# EAGLE design SHTC3 Breakout (EAGLE 9.1.3)
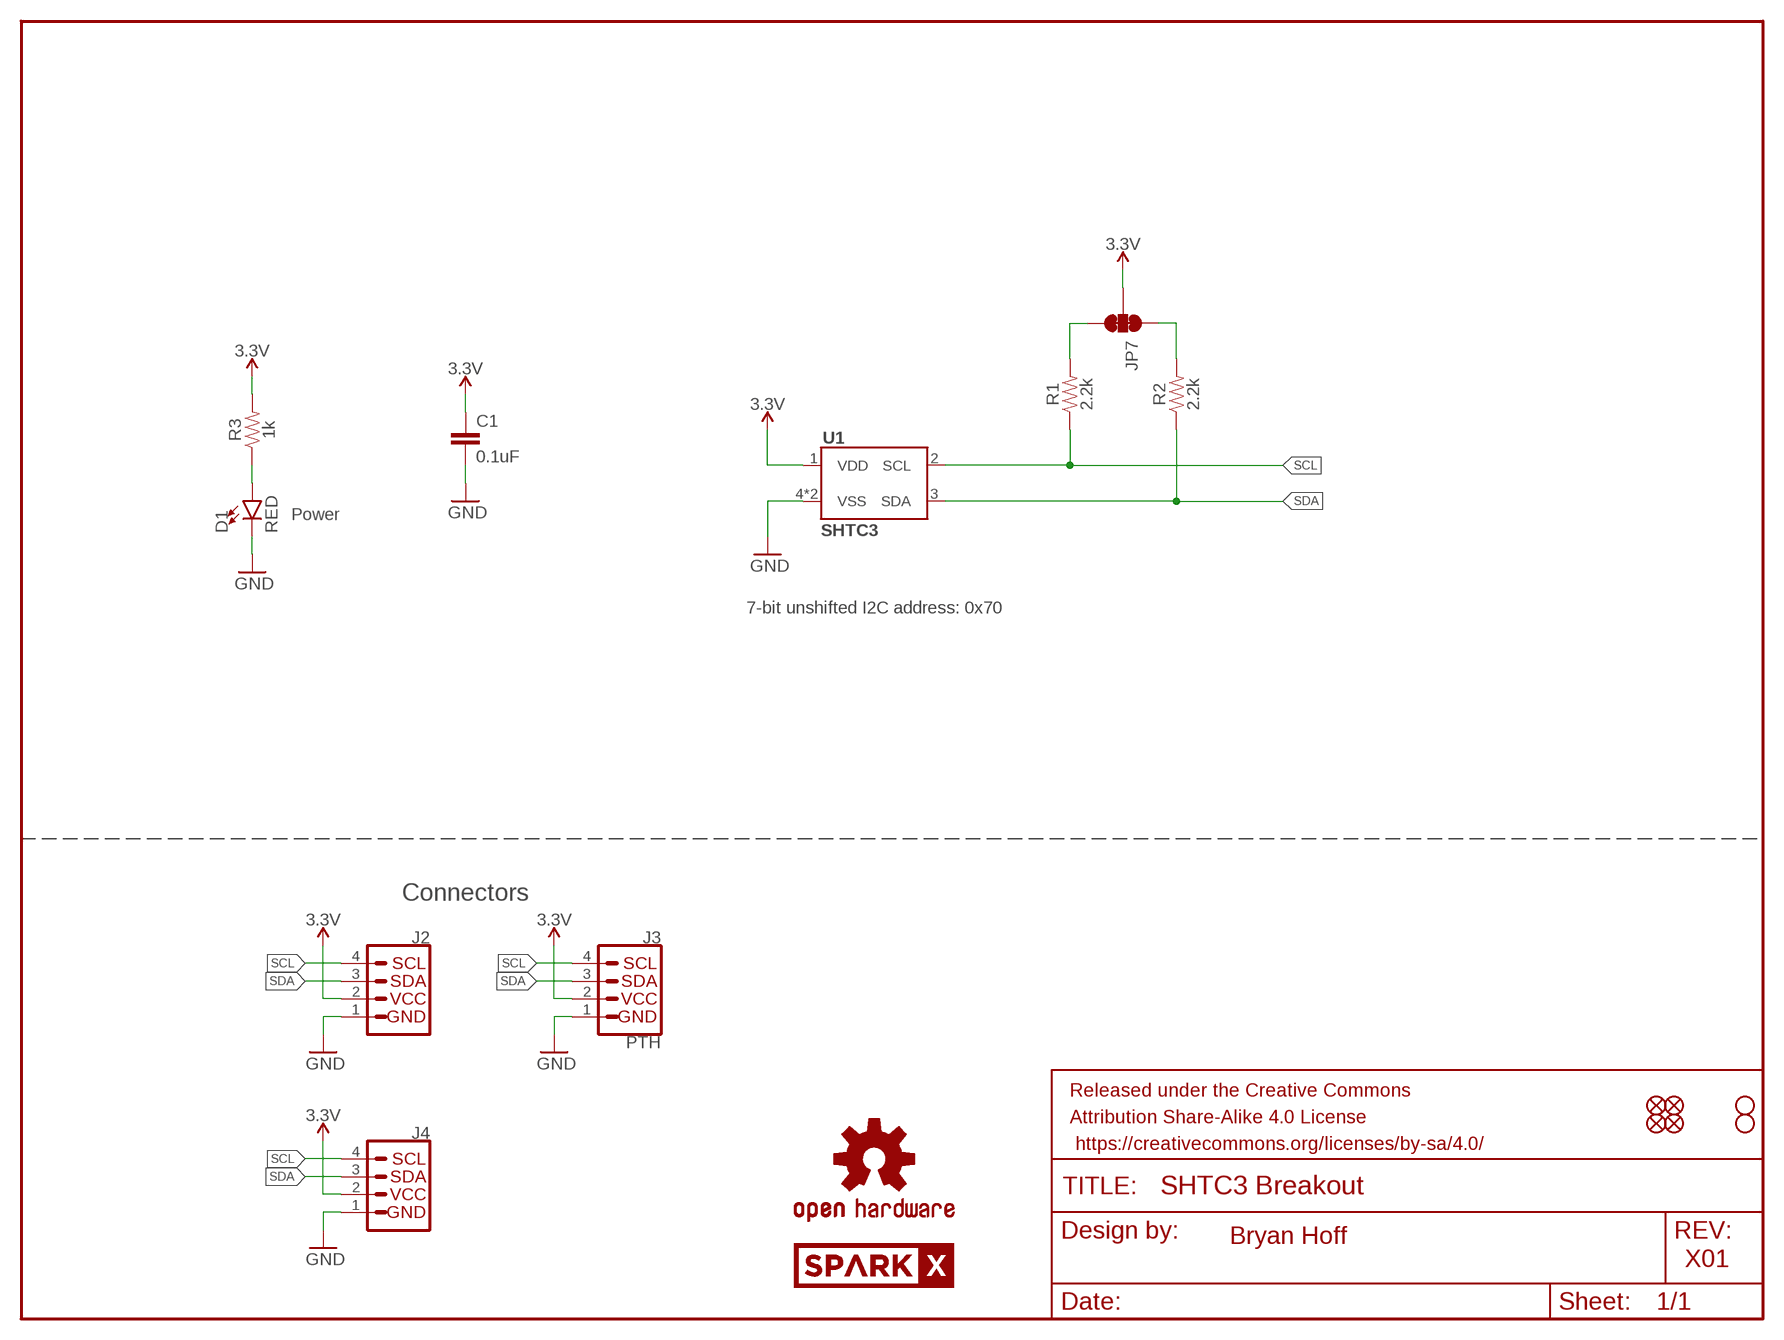
[diagram p0: schematic, sheet 1]

## Parts
C1  0.1uF  0.1UF-0603-25V-(+80/-20%)  [0603]
D1  RED  LED-RED0603  [LED-0603]
FRAME1  FRAME-LETTER  [CREATIVE_COMMONS]
J2  QWIIC_CONNECTORJS-1MM  [1X04_1MM_RA]
J3  PTH  I2C_STANDARD_NO_SILK  [1X04_NO_SILK]
J4  QWIIC_CONNECTORJS-1MM  [1X04_1MM_RA]
JP1  FIDUCIALUFIDUCIAL  [MICRO-FIDUCIAL]
JP2  FIDUCIALUFIDUCIAL  [MICRO-FIDUCIAL]
JP3  STAND-OFF  [STAND-OFF]
JP4  STAND-OFF  [STAND-OFF]
JP5  FIDUCIALUFIDUCIAL  [MICRO-FIDUCIAL]
JP6  FIDUCIALUFIDUCIAL  [MICRO-FIDUCIAL]
JP7  JUMPER-SMT_3_2-NC_TRACE_SILK  [SMT-JUMPER_3_2-NC_TRACE_SILK]
LOGO1  OSHW-LOGOMINI  [OSHW-LOGO-MINI]
R1  2.2k  2.2KOHM-0603-1/10W-1%  [0603]
R2  2.2k  2.2KOHM-0603-1/10W-1%  [0603]
R3  1k  1KOHM-0603-1/10W-1%  [0603]
U1  SHTC3  [SHTC3]
U$1  SPARKX-LOGO4  [SPARKX-MEDIUM]
U$2  SPARKX-LOGO4  [SPARKX-MEDIUM]

## Nets
3.3V: C1.1 J2.2 J3.2(VCC) J4.2 JP7.2 R3.2 U1.1(VDD)
GND: C1.2 D1.C J2.1 J3.1(GND) J4.1 U1.4(VSS) U1.5(VSS)
N$1: JP7.3 R1.2
N$2: JP7.1 R2.2
N$3: D1.A R3.1
SCL: J2.4 J3.4(SCL) J4.4 R1.1 U1.2(SCL)
SDA: J2.3 J3.3(SDA) J4.3 R2.1 U1.3(SDA)

## Notes on the sheet
- Power
- 7-bit unshifted I2C address: 0x70
- Connectors
- Bryan Hoff
- X01

## Library data of the parts
C1 = SparkFun-Capacitors:0.1UF: 0.1µF ceramic capacitors A capacitor is a passive two-terminal electrical component used to store electrical energy temporarily in an electric field.; PROD_ID: CAP-00810
D1 = SparkFun-LED:LED-RED: Red SMD LED Used in manufacturing of most products at SparkFun Packages: 0603 - SMD 0603 package [Product Link] <http://docs.avagotech.com/docs/AV02-0551EN> 0603 SMART - SMD 0603 SMART package ( more efficient and expensive)[Product Link] <http://www.osram-os.com/Graphics/XPic2/00077099_0.pdf> 1206 - SMD1206 package [Product Link] <https://www.sparkfun.com/datasheets/DevTools/LilyPad/Q150OVS4.pdff> SparkFun Products: Pro Mini 328 -5V <https://www.sparkfun.com/products/821> RedBoard <https://www.sparkfun.com/products/12757> IOIO-OTG <https://www.sparkfun.com/products/13613>; PROD_ID: DIO-00819
FRAME1 = SparkFun-Aesthetics:FRAME-LETTER: Schematic Frame - Letter Standard 8.5x11 US Letter frame
J2 J4 = SparkFun-Connectors:QWIIC_CONNECTOR: SparkFun I2C Standard Qwiic Connector An SMD 1mm pitch JST connector makes it easy and quick (get it? Qwiic?) to connect I2C devices to each other. The Qwiic system <http://www.sparkfun.com/qwiic> enables fast and solderless connection between popular platforms and various sensors and actuators. We carry 200mm <https://www.sparkfun.com/products/14204>, 100mm <https://www.sparkfun.com/products/14205>, 50mm <https://www.sparkfun.com/products/14206>, and breadboard friendly <https://www.sparkfun.com/products/14207> Qwiic cables. We also offer 10 pcs strips <https://www.sparkfun.com/products/14323> the SMD connectors.; PROD_ID: CONN-13694
J3 = SparkX:I2C_STANDARD: SparkFun I2C Standard Pinout Header SparkFun has standardized on a pinout for all I2C based sensor breakouts. This pinout allows I2C boards to be plugged directly into the headers on Arduino Uno compatible boards, and to be daisy chained easily. Example SparkFun Products: SparkFun Atmospheric Sensor Breakout - BME280 <https://www.sparkfun.com/products/13676> SparkFun Altitude/Pressure Sensor Breakout - MPL3115A2 <https://www.sparkfun.com/products/11084> SparkFun TOF Range Finder Sensor - VL6180 <https://www.sparkfun.com/products/12785>
JP1 JP2 JP5 JP6 = SparkFun:FIDUCIAL: Fiducial Alignment Points Various fiducial points for machine vision alignment.
JP3 JP4 = SparkFun:STAND-OFF: Stand Off This is the mechanical footprint for a #4 phillips button head screw. Use the keepout ring to avoid running the screw head into surrounding components. SKU : PRT-00447
JP7 = SparkFun-Jumpers:JUMPER-SMT_3_2-NC_TRACE: Normally closed trace jumper (2 of 2 connections) This jumper has a trace between all three pads so they are normally closed (NC). Use a razor knife to open the connection(s). For best results follow the IPC guidelines for cutting traces: Cutout at least 0.063 mm (0.005 in). Remove all loose material to clean up the cut area. Seal the cut with an approved epoxy. Reapply solder to reclose the connection(s).
LOGO1 = SparkFun-Aesthetics:OSHW-LOGO: Open-Source Hardware (OSHW) Logo This logo indicates the piece of hardware it is found on incorporates a OSHW license and/or adheres to the definition of open source hardware found here: http://freedomdefined.org/OSHW
R1 R2 = SparkFun-Resistors:2.2KOHM: 2.2kΩ resistor A resistor is a passive two-terminal electrical component that implements electrical resistance as a circuit element. Resistors act to reduce current flow, and, at the same time, act to lower voltage levels within circuits. - Wikipedia; PROD_ID: RES-08272
R3 = SparkFun-Resistors:1KOHM: 1kΩ resistor A resistor is a passive two-terminal electrical component that implements electrical resistance as a circuit element. Resistors act to reduce current flow, and, at the same time, act to lower voltage levels within circuits. - Wikipedia; PROD_ID: RES-07856
U1 = SHTC3:SHTC3
U$1 U$2 = SparkX:SPARKX-LOGO

## Net classes
1 power: width 0.203 mm

## Board
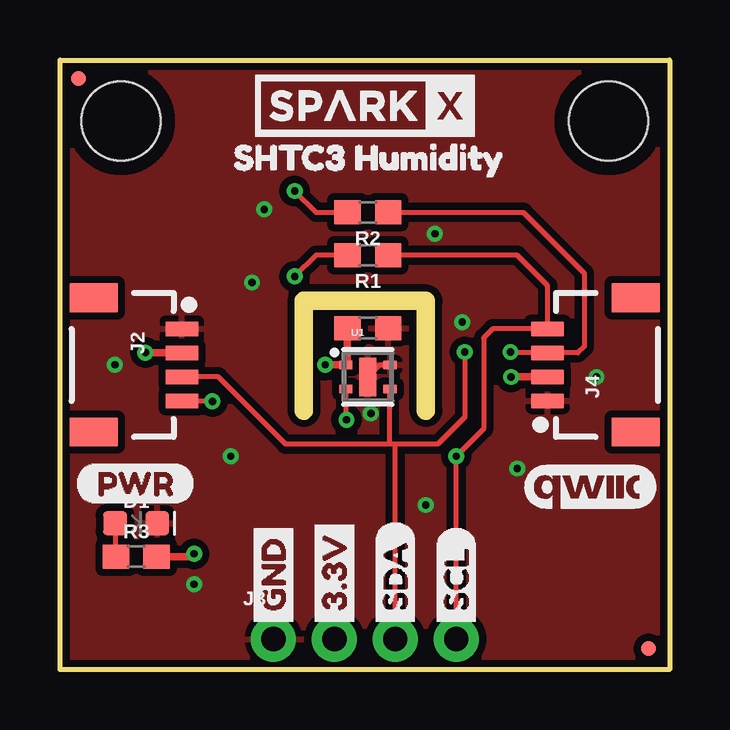
[diagram p1: board, top side]
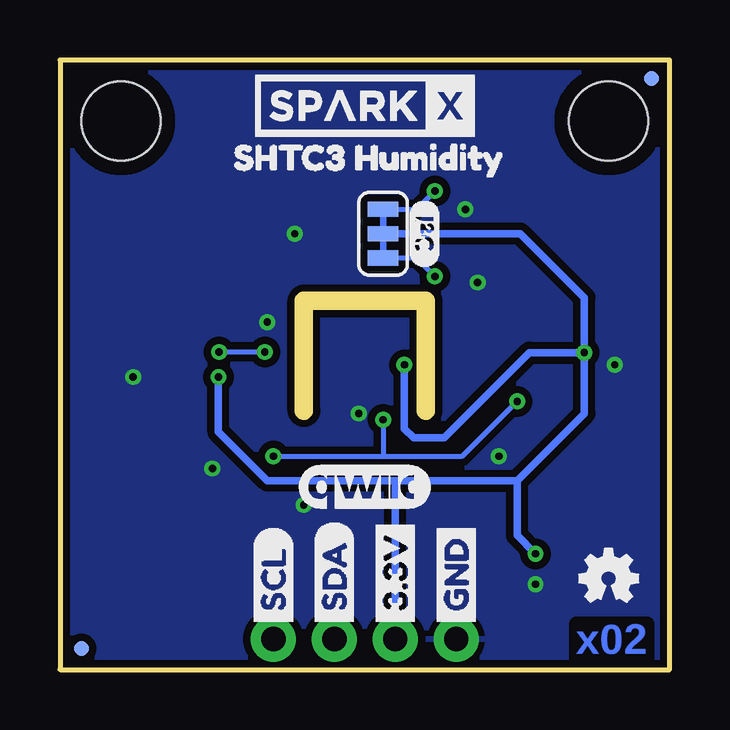
[diagram p2: board, bottom side, seen from below]

Size 25.4 x 25.4 mm. Coordinates in mm from the lower left corner, seen from the top.
Outline: 0,0 0,25.4 25.4,25.4 25.4,0 0,0
Copper layers (1*16): Top 0.035mm / dielectric 1.5mm / Bottom 0.035mm
Design rules "SparkFun-2-layer-TIGHT": minimum track width 7mil, minimum drill 15mil, track to track 7mil, track to pad 7mil, pad to pad 7mil, via to via 7mil, smd to smd 7mil, copper to edge 7mil, drill to drill 7mil, minimum pad ring 7mil, minimum via ring 7mil, stop-mask expansion 4mil, vias tented up to drill 25mil, thermal gap 10mil
tRestrict: 3 lines
bRestrict: 3 lines
Milling: 3 lines

### Footprints (pad centres in the part's own frame; a part is rotated, then mirrored left to right if it is on the bottom)
0603 = smd 1.1 x 1: 1 -0.85,0; 2 0.85,0
LED-0603 = smd 1 x 1: A -0.877,0; C 0.877,0
1X04_1MM_RA = smd 0.6 x 1.35: 1 -1.5,0; 2 -0.5,0; 3 0.5,0; 4 1.5,0 | smd 1.2 x 2: NC1 2.8,-3.675; NC2 -2.8,-3.675
1X04_NO_SILK = drill 1.016 pad 1.88: 1 0,0; 2 2.54,0; 3 5.08,0; 4 7.62,0
MICRO-FIDUCIAL = smd 0.635 x 0.635: 1 0,0
STAND-OFF = hole 3.302: 0,0
SMT-JUMPER_3_2-NC_TRACE_SILK = smd 0.635 x 1.27: 1 -1.016,0; 2 0,0; 3 1.016,0
SHTC3 = smd 0.55 x 0.35: 1 -0.925,0.5; 2 -0.925,-0.5; 3 0.925,-0.5; 4 0.925,0.5 | smd 0.7 x 1.6: 5 0,0

### Placement (x,y rotation side)
C1  12.83,14.22 0 top
D1  3.17,6.1 0 top
FRAME1  -12.7,-19.05 0 top  (outside the outline)
J2  5.08,12.7 270 top
J3  8.89,1.27 0 top
J4  20.32,12.7 90 top
JP1  0.76,24.64 0 bottom
JP2  24.51,0.89 0 top
JP3  2.54,22.86 0 top
JP4  22.86,22.86 0 top
JP5  24.51,0.89 0 bottom
JP6  0.76,24.64 0 top
JP7  11.94,18.16 270 bottom
LOGO1  2.54,3.81 0 bottom
R1  12.83,17.27 180 top
R2  12.83,19.05 180 top
R3  3.17,4.7 0 top
U1  12.83,12.19 0 top
U$1  12.7,23.5 0 top
U$2  12.7,23.5 0 bottom
U$3  [GND1]  8.89,1.52 90 bottom
U$4  [3#3V2]  11.43,1.52 90 bottom
U$5  [SDA8]  13.97,1.52 90 bottom
U$6  [SCL9]  16.51,1.52 90 bottom
U$7  [SHTC3_HUMIDITY1]  19.05,21.34 0 bottom
U$8  [SHTC3_HUMIDITY1]  6.35,21.34 0 top
U$9  [I_SUPER2_C-()-03]  10.21,19.58 270 bottom
U$10  [(PWR)]  0.64,7.75 0 top
U$11  [QWIIC_5.5MM]  22.1,7.62 0 top
U$12  [QWIIC_5.5MM]  12.7,7.62 0 bottom
U$21  [3#3V2]  11.43,1.52 90 top
U$22  [GND1]  8.89,1.52 90 top
U$26  [SCL9]  16.51,1.52 90 top
U$27  [SDA8]  13.97,1.52 90 top

### Tracks (layer width: path | path; a pad name or v marks a point on that pad's centre or on a via)
3.3V  (via drill 0.3)
  Top 0.305: v18.8,12.19 J4.2 | v3.56,13.21 J2.2 | v11.05,12.7 v11.06,12.69 U1.1 11.98,12.77 C1.1 | R3.2 5.46,4.7 v5.59,4.83
  Bottom 0.305: J3.2 11.43,7.87 | 11.43,7.87 16.76,7.87 18.8,9.91 v18.8,12.19 | 6.35,7.87 3.56,10.67 v3.56,13.21 | v11.05,12.7 11.05,10.03 10.67,9.65 9.4,9.65 5.84,13.21 v3.56,13.21 | v5.59,4.83 6.35,5.59 6.35,7.87 | 11.43,7.87 6.35,7.87 | v3.56,13.21 3.56,15.49 6.22,18.16 JP7.2
GND  (via drill 0.3)
  Top 0.203: U1.5 13.33,12.69 U1.4
  other vias: 15.24,6.86 19.05,8.38 15.62,18.16 2.29,12.7 16.76,14.48 8.51,19.18 7.11,8.89 22.35,12.19 5.59,3.56 8,16.13 12.95,10.67
  pour Bottom (isolate 0.305): 0,0 0,25.4 25.4,25.4 25.4,0
  pour Top (isolate 0.305): 0,0 0,25.4 25.4,25.4 25.4,0
N$1  (via drill 0.3)
  Top 0.203: R1.2 10.67,17.27 v9.78,16.38
  Bottom 0.203: v9.78,16.38 10.54,17.14 JP7.3
N$2  (via drill 0.3)
  Top 0.203: R2.2 10.67,19.05 v9.78,19.94
  Bottom 0.203: v9.78,19.94 10.54,19.18 JP7.1
N$3
  Top 0.203: R3.1 2.33,6.07
  Top 0.254: 2.33,6.07 D1.A
SCL  (via drill 0.3)
  Top 0.203: v6.35,11.18 5.1,11.18 | J3.4 v16.51,8.89 17.65,10.03 17.65,13.82 18.03,14.2 J4.4 20.32,16 19.05,17.27 R1.1 | U1.2 11.9,10.45 v11.94,10.41
  Top 0.254: 5.1,11.18 J2.4
  Bottom 0.203: v6.35,11.18 8.64,8.89 11.94,8.89 | v16.51,8.89 11.94,8.89 | v11.94,10.41 11.94,8.89
SDA  (via drill 0.3)
  Top 0.203: J2.3 6.6,12.19 9.4,9.4 13.72,9.4 | v16.87,13.23 16.87,10.52 15.75,9.4 13.97,9.4 | 13.97,9.4 13.72,9.4 | J3.3 13.97,9.4 | U1.3 13.72,11.66 13.72,9.4 | R2.1 19.3,19.05 21.84,16.51 21.84,13.46 21.58,13.2 J4.3 18.8,13.2 v18.77,13.23
  Top 0.254: J2.3
  Bottom 0.203: v18.77,13.23 v16.87,13.23

### Text on the board
Bottom: x02
Measures: Dimensions in inches
tDocu: Bryan Hoff